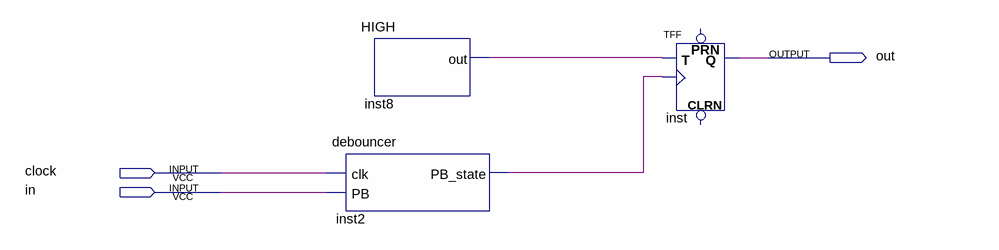
[diagram p0: schematic sheet]
// Quartus schematic POPO_v1.bdf as structural Verilog: 3 symbols, 3 pins
module POPO_v1 (
  input  clock,
  input  in,
  output out
);

  wire inst2_pb_state, inst8_out;

  HIGH inst8 (.out(inst8_out));
  debouncer inst2 (.clk(clock), .PB(in), .PB_state(inst2_pb_state));
  TFF inst (.T(inst8_out), .CLK(inst2_pb_state), .Q(out));  // open: PRN, CLRN
endmodule
